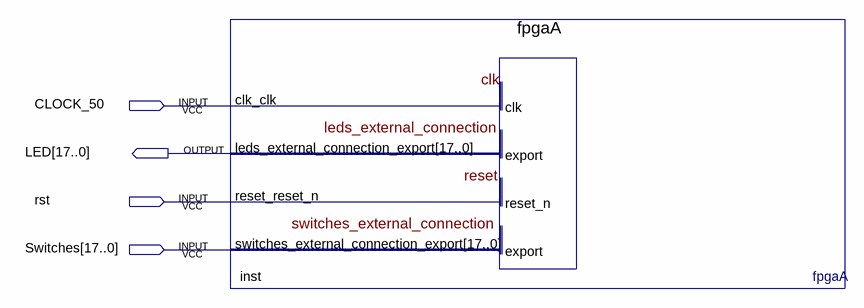
[diagram p0: schematic sheet]
// Quartus schematic hidden_layer.bdf as structural Verilog: 1 symbols, 4 pins
module hidden_layer (
  input  CLOCK_50,
  input  rst,
  input  [17:0] Switches,
  output [17:0] LED
);

  fpgaA inst (
    .clk_clk(CLOCK_50), .reset_reset_n(rst), .switches_external_connection_export(Switches),
    .leds_external_connection_export(LED));
endmodule
